# Altium schematic sheet NORA_V0.01.SchDoc
size A3; Value: 13nH
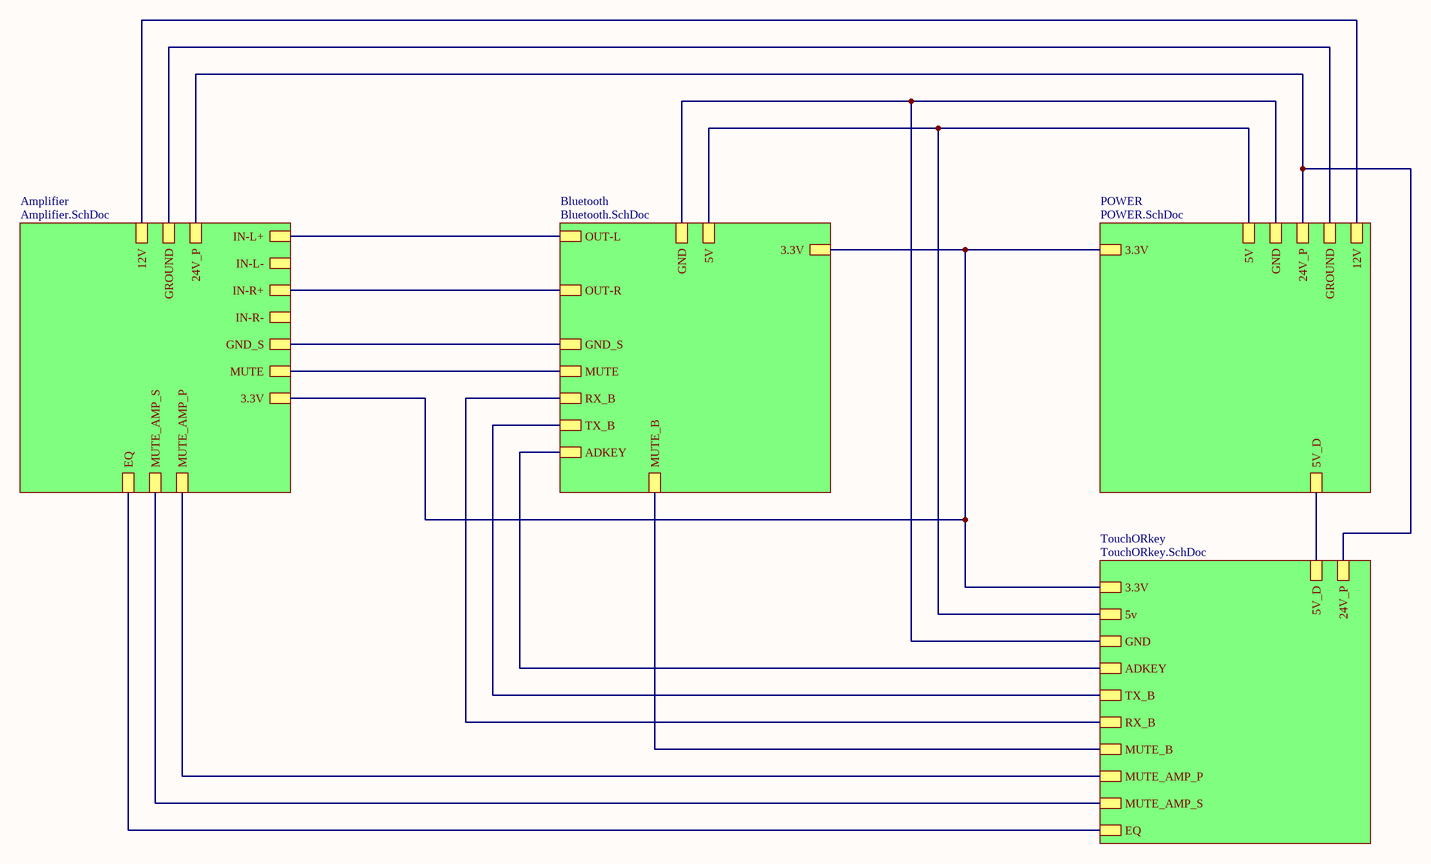
[diagram p0: NORA_V0.01.SchDoc]

## Sub-sheets
Amplifier = Amplifier.SchDoc: IN-L+, IN-L-, IN-R+, IN-R-, MUTE, 24V_P, GROUND, GND_S, 3.3V, 12V, MUTE_AMP_P, MUTE_AMP_S, EQ
Bluetooth = Bluetooth.SchDoc: OUT-L, OUT-R, 3.3V, GND_S, GND, 5V, MUTE, RX_B, TX_B, ADKEY, MUTE_B
POWER = POWER.SchDoc: 3.3V, GND, 5V, 24V_P, GROUND, 12V, 5V_D
TouchORkey = TouchORkey.SchDoc: ADKEY, 3.3V, 5v, GND, TX_B, RX_B, 5V_D, 24V_P, MUTE_AMP_S, MUTE_B, MUTE_AMP_P, EQ

## Nets
(unnamed): sheet Amplifier/IN-L+, sheet Bluetooth/OUT-L
(unnamed): sheet Amplifier/IN-R+, sheet Bluetooth/OUT-R
(unnamed): sheet Amplifier/MUTE, sheet Bluetooth/MUTE
(unnamed): sheet Amplifier/24V_P, sheet POWER/24V_P, sheet TouchORkey/24V_P
(unnamed): sheet Amplifier/GROUND, sheet POWER/GROUND
(unnamed): sheet Amplifier/GND_S, sheet Bluetooth/GND_S
(unnamed): sheet Amplifier/3.3V, sheet Bluetooth/3.3V, sheet POWER/3.3V, sheet TouchORkey/3.3V
(unnamed): sheet Amplifier/12V, sheet POWER/12V
(unnamed): sheet Amplifier/MUTE_AMP_P, sheet TouchORkey/MUTE_AMP_P
(unnamed): sheet Amplifier/MUTE_AMP_S, sheet TouchORkey/MUTE_AMP_S
(unnamed): sheet Amplifier/EQ, sheet TouchORkey/EQ
(unnamed): sheet Bluetooth/GND, sheet POWER/GND, sheet TouchORkey/GND
(unnamed): sheet Bluetooth/5V, sheet POWER/5V, sheet TouchORkey/5v
(unnamed): sheet Bluetooth/RX_B, sheet TouchORkey/RX_B
(unnamed): sheet Bluetooth/TX_B, sheet TouchORkey/TX_B
(unnamed): sheet Bluetooth/ADKEY, sheet TouchORkey/ADKEY
(unnamed): sheet Bluetooth/MUTE_B, sheet TouchORkey/MUTE_B
(unnamed): sheet POWER/5V_D, sheet TouchORkey/5V_D

## Notes on the sheet
- Title
- Size:
- Date:
- A3
- Number:
- Time:
- Revision:
- Sheet
- of
- File: